# Altium schematic sheet 1.toplevel.SchDoc
size A3; Organization: Altium Limited; Address1: L3, 12a Rodborough Rd; Address2: Frenchs Forest; Address3: NSW; Address4: Australia 2086; SheetNumber: 1; SheetTotal: 4
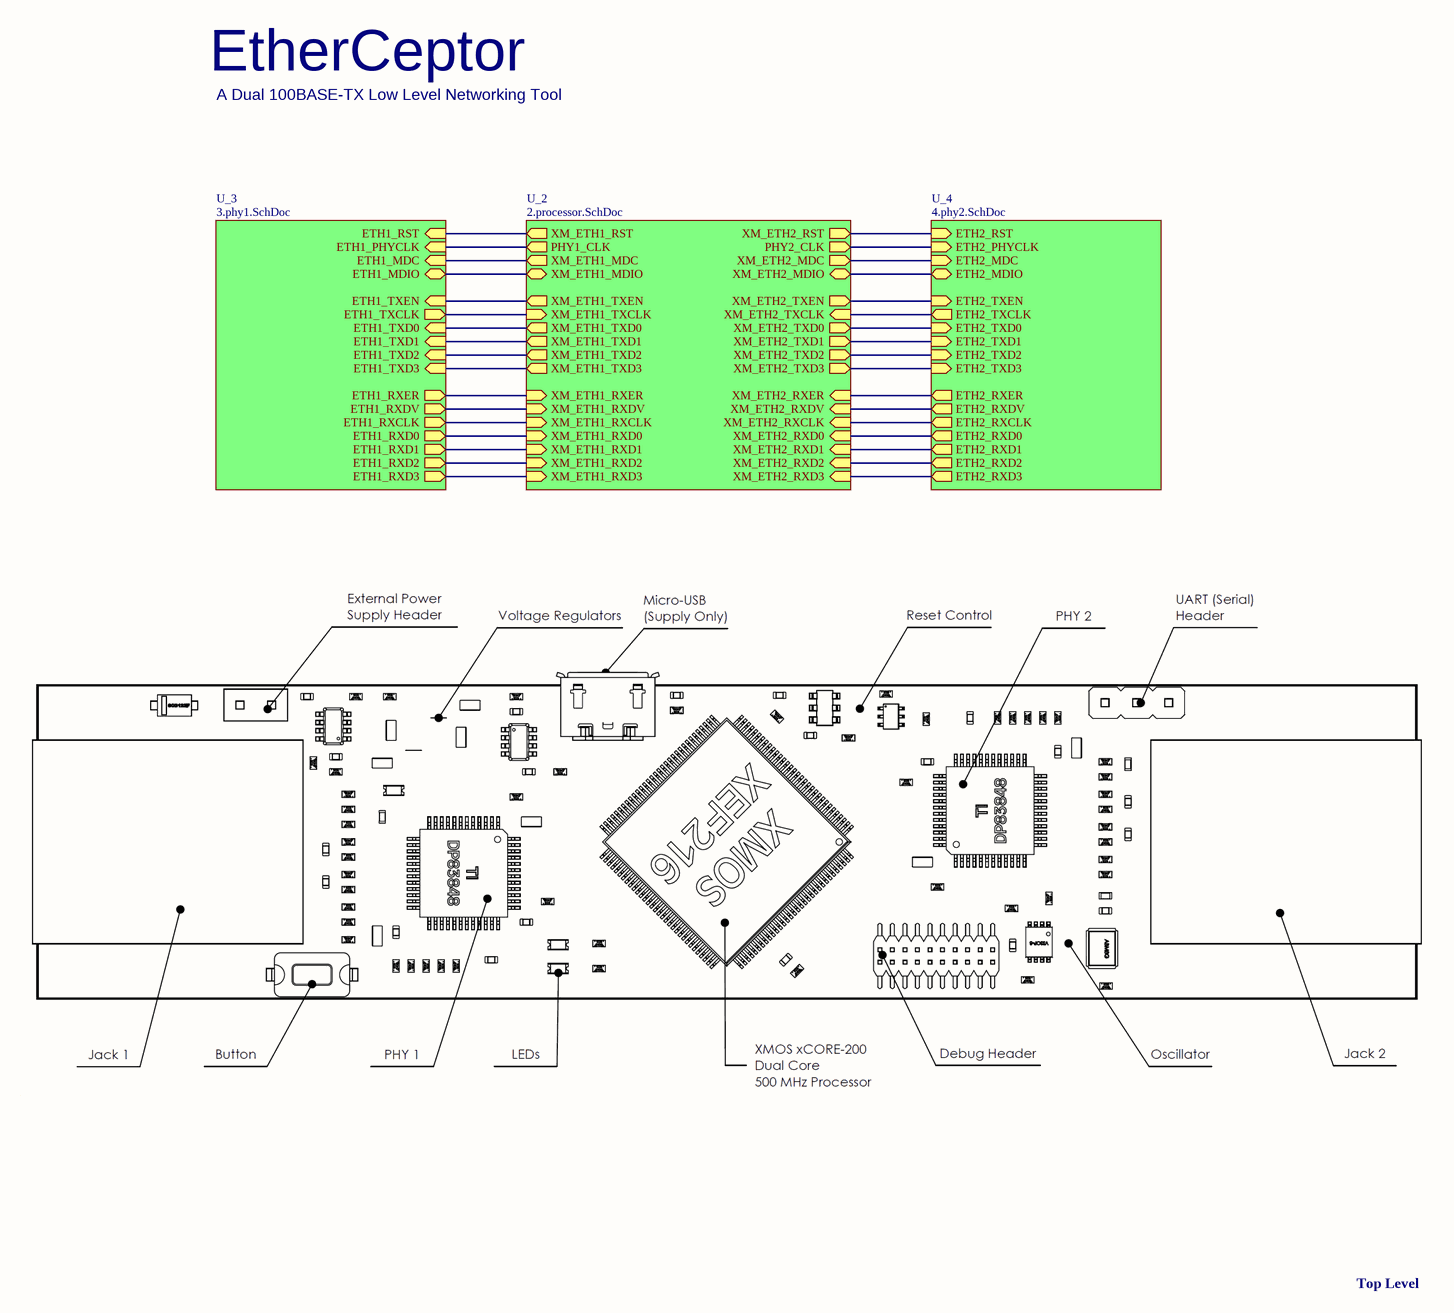
[diagram p0: 1.toplevel.SchDoc]

## Sub-sheets
U_2 = 2.processor.SchDoc: PHY1_CLK (out), PHY2_CLK (out), XM_ETH1_RST (out), XM_ETH1_TXCLK (in), XM_ETH1_TXD0 (out), XM_ETH1_TXD1 (out), XM_ETH1_TXD2 (out), XM_ETH1_TXD3 (out), XM_ETH1_TXEN (out), XM_ETH1_MDIO (bidir), XM_ETH1_MDC (out), XM_ETH1_RXER (in), XM_ETH1_RXDV (in), XM_ETH1_RXD0 (in), XM_ETH1_RXD1 (in), XM_ETH1_RXD2 (in), XM_ETH1_RXD3 (in), XM_ETH1_RXCLK (in), XM_ETH2_RST (out), XM_ETH2_TXCLK (in), XM_ETH2_TXD0 (out), XM_ETH2_TXD1 (out), XM_ETH2_TXD2 (out), XM_ETH2_TXD3 (out), XM_ETH2_TXEN (out), XM_ETH2_MDIO (bidir), XM_ETH2_MDC (out), XM_ETH2_RXER (in), XM_ETH2_RXDV (in), XM_ETH2_RXD0 (in), XM_ETH2_RXD1 (in), XM_ETH2_RXD2 (in), XM_ETH2_RXD3 (in), XM_ETH2_RXCLK (in)
U_3 = 3.phy1.SchDoc: ETH1_TXCLK (out), ETH1_RST (in), ETH1_TXD0 (in), ETH1_TXD1 (in), ETH1_TXD2 (in), ETH1_TXD3 (in), ETH1_TXEN (in), ETH1_MDC (in), ETH1_MDIO (bidir), ETH1_RXER (out), ETH1_RXDV (out), ETH1_RXD0 (out), ETH1_RXD1 (out), ETH1_RXD2 (out), ETH1_RXD3 (out), ETH1_RXCLK (out), ETH1_PHYCLK (in)
U_4 = 4.phy2.SchDoc: ETH2_TXCLK (out), ETH2_RST (in), ETH2_TXD0 (in), ETH2_TXD1 (in), ETH2_TXD2 (in), ETH2_TXD3 (in), ETH2_TXEN (in), ETH2_MDC (in), ETH2_MDIO (bidir), ETH2_RXER (out), ETH2_RXDV (out), ETH2_RXD0 (out), ETH2_RXD1 (out), ETH2_RXD2 (out), ETH2_RXD3 (out), ETH2_RXCLK (out), ETH2_PHYCLK (in)

## Nets
(unnamed): sheet U_3/ETH1_TXCLK, sheet U_2/XM_ETH1_TXCLK
(unnamed): sheet U_3/ETH1_RST, sheet U_2/XM_ETH1_RST
(unnamed): sheet U_3/ETH1_TXD0, sheet U_2/XM_ETH1_TXD0
(unnamed): sheet U_3/ETH1_TXD1, sheet U_2/XM_ETH1_TXD1
(unnamed): sheet U_3/ETH1_TXD2, sheet U_2/XM_ETH1_TXD2
(unnamed): sheet U_3/ETH1_TXD3, sheet U_2/XM_ETH1_TXD3
(unnamed): sheet U_3/ETH1_TXEN, sheet U_2/XM_ETH1_TXEN
(unnamed): sheet U_3/ETH1_MDC, sheet U_2/XM_ETH1_MDC
(unnamed): sheet U_3/ETH1_MDIO, sheet U_2/XM_ETH1_MDIO
(unnamed): sheet U_3/ETH1_RXER, sheet U_2/XM_ETH1_RXER
(unnamed): sheet U_3/ETH1_RXDV, sheet U_2/XM_ETH1_RXDV
(unnamed): sheet U_3/ETH1_RXD0, sheet U_2/XM_ETH1_RXD0
(unnamed): sheet U_3/ETH1_RXD1, sheet U_2/XM_ETH1_RXD1
(unnamed): sheet U_3/ETH1_RXD2, sheet U_2/XM_ETH1_RXD2
(unnamed): sheet U_3/ETH1_RXD3, sheet U_2/XM_ETH1_RXD3
(unnamed): sheet U_3/ETH1_RXCLK, sheet U_2/XM_ETH1_RXCLK
(unnamed): sheet U_3/ETH1_PHYCLK, sheet U_2/PHY1_CLK
(unnamed): sheet U_4/ETH2_TXCLK, sheet U_2/XM_ETH2_TXCLK
(unnamed): sheet U_4/ETH2_RST, sheet U_2/XM_ETH2_RST
(unnamed): sheet U_4/ETH2_TXD0, sheet U_2/XM_ETH2_TXD0
(unnamed): sheet U_4/ETH2_TXD1, sheet U_2/XM_ETH2_TXD1
(unnamed): sheet U_4/ETH2_TXD2, sheet U_2/XM_ETH2_TXD2
(unnamed): sheet U_4/ETH2_TXD3, sheet U_2/XM_ETH2_TXD3
(unnamed): sheet U_4/ETH2_TXEN, sheet U_2/XM_ETH2_TXEN
(unnamed): sheet U_4/ETH2_MDC, sheet U_2/XM_ETH2_MDC
(unnamed): sheet U_4/ETH2_MDIO, sheet U_2/XM_ETH2_MDIO
(unnamed): sheet U_4/ETH2_RXER, sheet U_2/XM_ETH2_RXER
(unnamed): sheet U_4/ETH2_RXDV, sheet U_2/XM_ETH2_RXDV
(unnamed): sheet U_4/ETH2_RXD0, sheet U_2/XM_ETH2_RXD0
(unnamed): sheet U_4/ETH2_RXD1, sheet U_2/XM_ETH2_RXD1
(unnamed): sheet U_4/ETH2_RXD2, sheet U_2/XM_ETH2_RXD2
(unnamed): sheet U_4/ETH2_RXD3, sheet U_2/XM_ETH2_RXD3
(unnamed): sheet U_4/ETH2_RXCLK, sheet U_2/XM_ETH2_RXCLK
(unnamed): sheet U_4/ETH2_PHYCLK, sheet U_2/PHY2_CLK

## Notes on the sheet
- EtherCeptor
- A Dual 100BASE-TX Low Level Networking Tool
- Top Level
- Title
- Size:
- Date:
- A3
- Number:
- Time:
- Revision:
- Sheet
- of
- File: